# Altium schematic sheet DI_DO.SchDoc
size A3; SheetNumber: 4; SheetTotal: 4
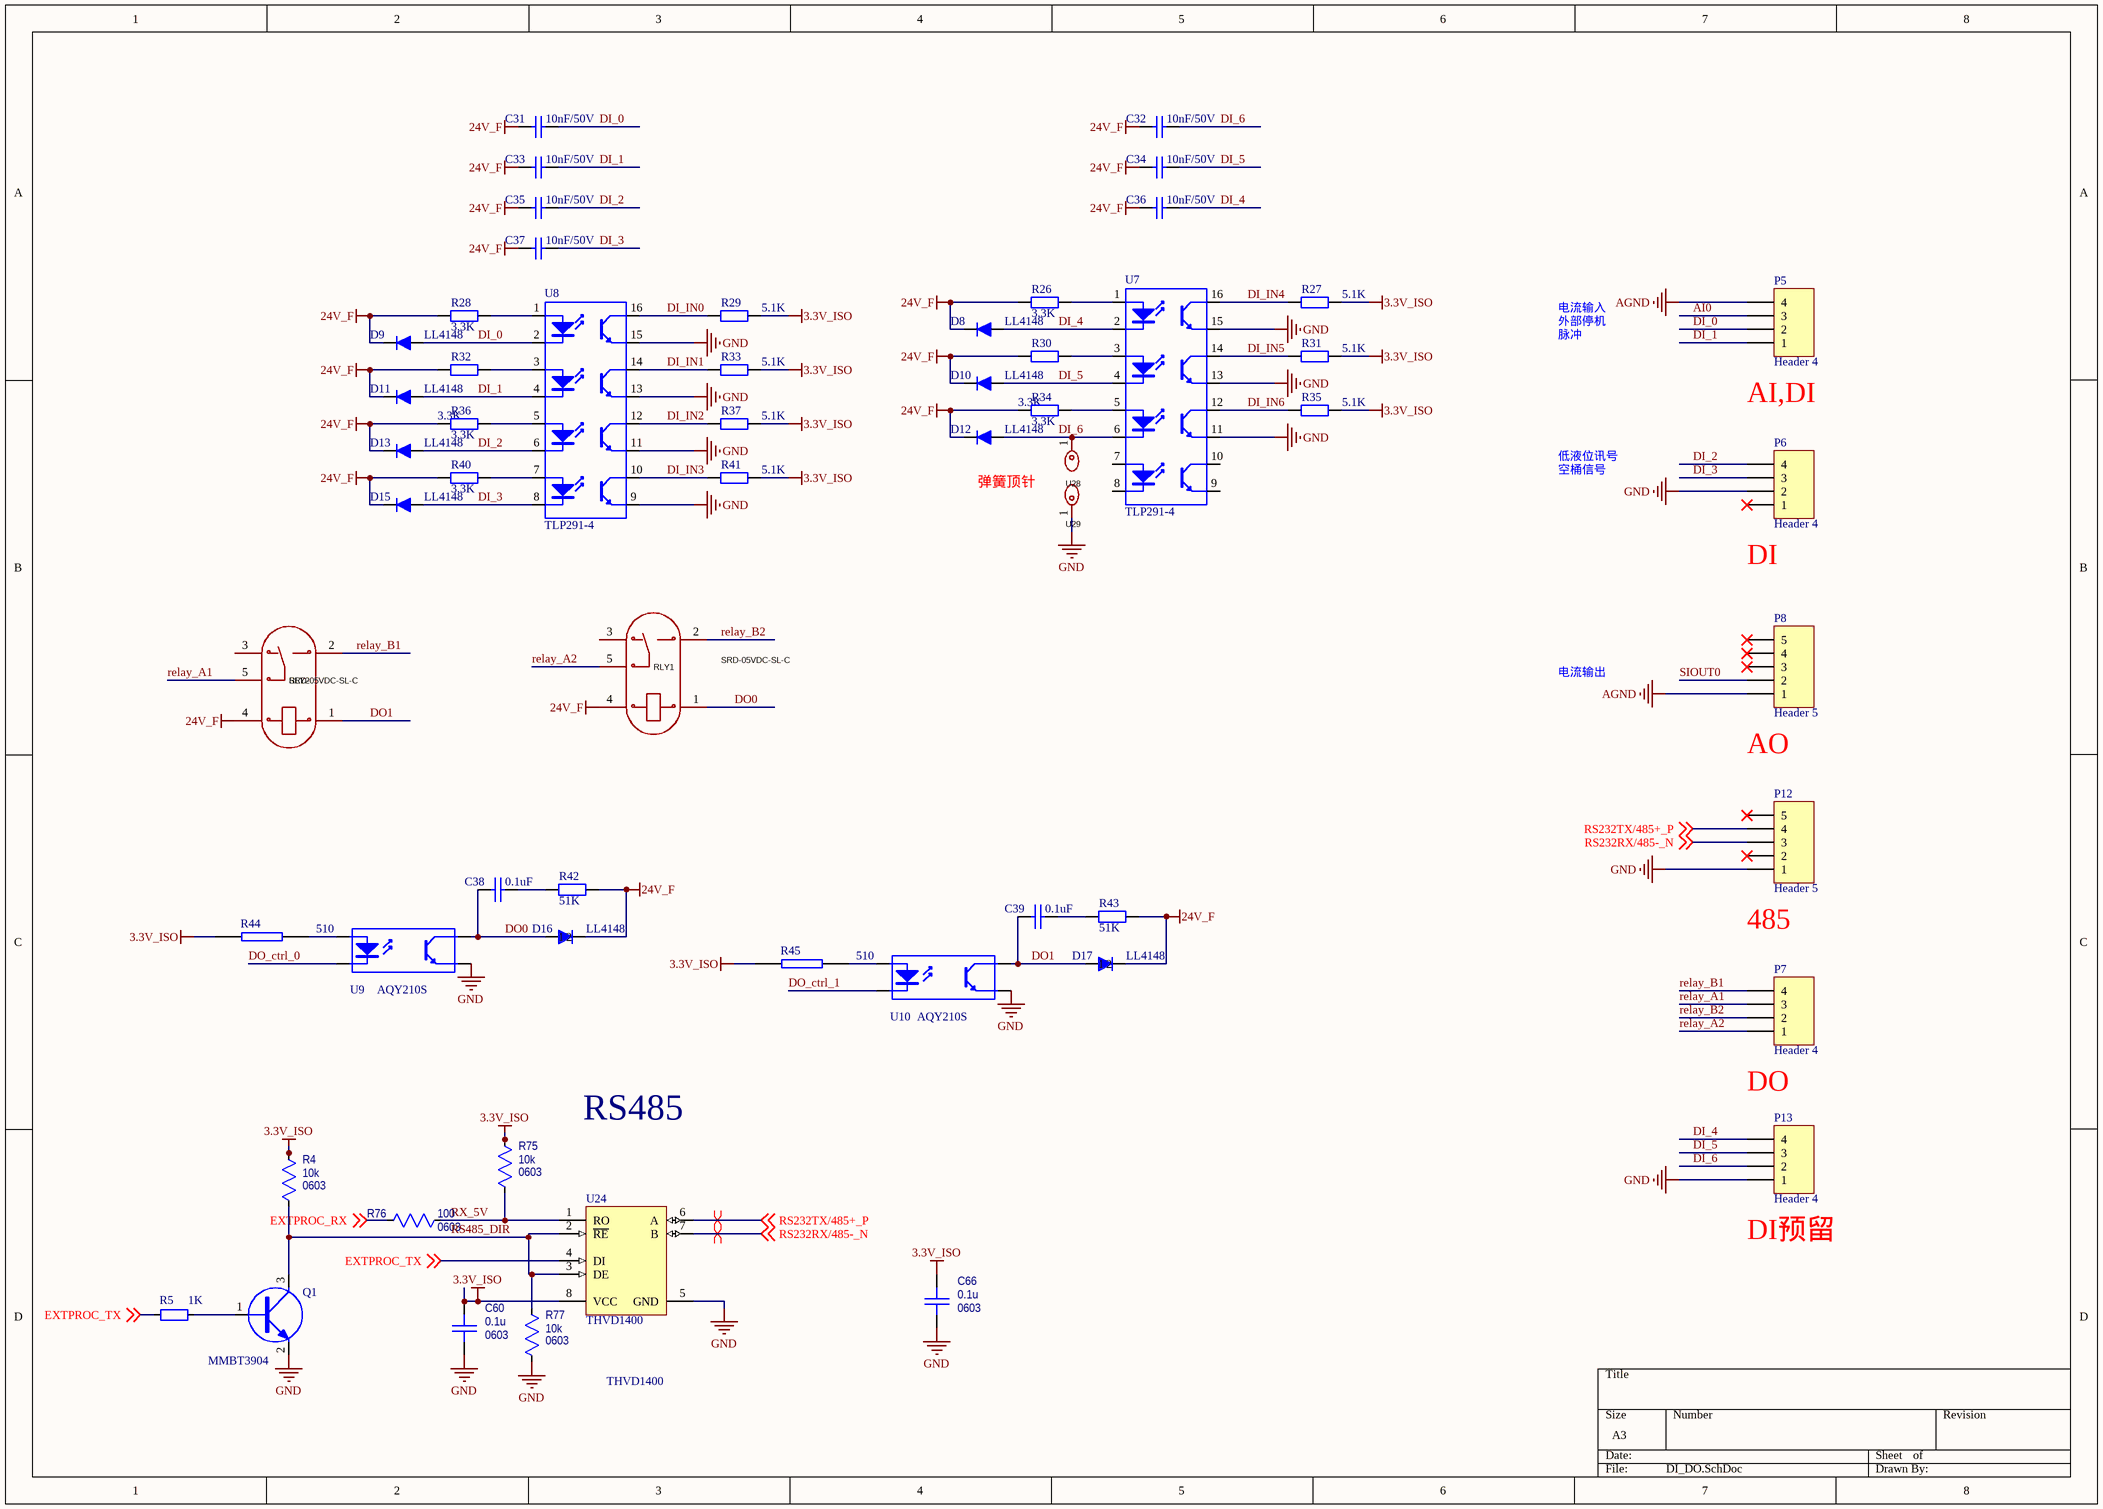
[diagram p0: DI_DO.SchDoc]

## Parts
C31  10nF/50V  [0603C]
C32  10nF/50V  [0603C]
C33  10nF/50V  [0603C]
C34  10nF/50V  [0603C]
C35  10nF/50V  [0603C]
C36  10nF/50V  [0603C]
C37  10nF/50V  [0603C]
C38  0.1uF  [0603C]
C39  0.1uF  [0603C]
C60  value 0.1u  Package: 0603  [CAPC1608X092N_0603]  (hidden comment: Capacitor_0603)
C66  value 0.1u  Package: 0603  [CAPC1608X092N_0603]  (hidden comment: Capacitor_0603)
D8  LL4148  [DO-213AB/LL34/MiniMELF]
D9  LL4148  [DO-213AB/LL34/MiniMELF]
D10  LL4148  [DO-213AB/LL34/MiniMELF]
D11  LL4148  [DO-213AB/LL34/MiniMELF]
D12  LL4148  [DO-213AB/LL34/MiniMELF]
D13  LL4148  [DO-213AB/LL34/MiniMELF]
D15  LL4148  [DO-213AB/LL34/MiniMELF]
D16  LL4148  [DO-213AB/LL34/MiniMELF]
D17  LL4148  [DO-213AB/LL34/MiniMELF]
P5  Header 4  [CONN#PH2.0-4A]
P6  Header 4  [CONN#PH2.0-4A]
P7  Header 4  [CONN#PH2.0-4A]
P8  Header 5  [CONN#PH2.0-5A]
P12  Header 5  [CONN#PH2.0-5A]
P13  Header 4  [CONN#PH2.0-4A]
Q1  MMBT3904  [SOT23-3]
R4  value 10k  Package: 0603  [RESC1608X055N_0603]  (hidden comment: Resistor_0603)
R5  1K  [0603r]
R26  3.3K  [0603R]
R27  5.1K  [0603R]
R28  3.3K  [0603R]
R29  5.1K  [0603R]
R30  3.3K  [0603R]
R31  5.1K  [0603R]
R32  3.3K  [0603R]
R33  5.1K  [0603R]
R34  3.3K  [0603R]
R35  5.1K  [0603R]
R36  3.3K  [0603R]
R37  5.1K  [0603R]
R40  3.3K  [0603R]
R41  5.1K  [0603R]
R42  51K  [0603R]
R43  51K  [0603R]
R44  510  [0603R]
R45  510  [0603R]
R75  value 10k  Package: 0603  [RESC1608X055N_0603]  (hidden comment: Resistor_0603)
R76  value 100  Package: 0603  [RESC1608X055N_0603]  (hidden comment: Resistor_0603)
R77  value 10k  Package: 0603  [RESC1608X055N_0603]  (hidden comment: Resistor_0603)
RLY1  SRD-05VDC-SL-C  [RELAY-TH_SRD-XXVDC-XL-C]
RLY2  SRD-05VDC-SL-C  [RELAY-TH_SRD-XXVDC-XL-C]
U7  TLP291-4  [SOP16-T]
U8  TLP291-4  [SOP16-T]
U9  AQY210S  [sop4]
U10  AQY210S  [sop4]
U24  THVD1400  [MAXM-S8+4_M]
U28  YTC1P-3015-01  [CONN-SMD_YTC1P-3015-01]  (value not drawn)
U29  YTC1P-3015-01  [CONN-SMD_YTC1P-3015-01]  (value not drawn)

## Nets
3.3V_ISO: C60.1 C66.1 R4.2 R27.1 R29.1 R31.1 R33.1 R35.1 R37.1 R41.1 R44.2 R45.2 R75.2 U24.8(VCC)
24V_F: C31.1 C32.1 C33.1 C34.1 C35.1 C36.1 C37.1 D8.2 D9.2 D10.2 D11.2 D12.2 D13.2 D15.2 D16.2(1) D17.2(1) R26.2 R28.2 R30.2 R32.2 R34.2 R36.2 R40.2 R42.2 R43.2 RLY1.4 RLY2.4
AGND: P5.4 P8.1
GND: C60.2 C66.2 P6.2 P12.1 P13.1 Q1.2(E) R77.1 U7.11(E) U7.13(E) U7.15(E) U8.9(E) U8.11(E) U8.13(E) U8.15(E) U9.3(E) U10.3(E) U24.5(GND) U29.1
AI0: P5.3
DI_0: C31.2 D9.1 P5.2 U8.2(K)
DI_1: C33.2 D11.1 P5.1 U8.4(K)
DI_2: C35.2 D13.1 P6.4 U8.6(K)
DI_3: C37.2 D15.1 P6.3 U8.8(K)
DI_4: C36.2 D8.1 P13.4 U7.2(K)
DI_5: C34.2 D10.1 P13.3 U7.4(K)
DI_6: C32.2 D12.1 P13.2 U7.6(K) U28.1
DI_IN0: R29.2 U8.16(C)
DI_IN1: R33.2 U8.14(C)
DI_IN2: R37.2 U8.12(C)
DI_IN3: R41.2 U8.10(C)
DI_IN4: R27.2 U7.16(C)
DI_IN5: R31.2 U7.14(C)
DI_IN6: R35.2 U7.12(C)
DO0: C38.1 D16.1(2) RLY1.1 U9.4(C)
DO1: C39.1 D17.1(2) RLY2.1 U10.4(C)
DO_ctrl_0: U9.2(K)
DO_ctrl_1: U10.2(K)
EXTPROC_RX: R76.2 ; off-sheet EXTPROC_RX
EXTPROC_TX: R5.1 U24.4(DI) ; off-sheet EXTPROC_TX
relay_A1: P7.3 RLY2.5
relay_A2: P7.1 RLY1.5
relay_B1: P7.4 RLY2.2
relay_B2: P7.2 RLY1.2
RS232RX/485-_N: P12.3 U24.7(B) ; off-sheet RS232RX/485-_N
RS232TX/485+_P: P12.4 U24.6(A) ; off-sheet RS232TX/485+_P
RS485_DIR: Q1.3(C) R4.1 R77.2 U24.2(~{RE}) U24.3(DE)
RX_5V: R75.1 R76.1 U24.1(RO)
SIOUT0: P8.2
NetC38_2: C38.2 R42.1
NetC39_2: C39.2 R43.1
NetQ1_1: Q1.1(B) R5.2
NetR26_1: R26.1 U7.1(A)
NetR28_1: R28.1 U8.1(A)
NetR30_1: R30.1 U7.3(A)
NetR32_1: R32.1 U8.3(A)
NetR34_1: R34.1 U7.5(A)
NetR36_1: R36.1 U8.5(A)
NetR40_1: R40.1 U8.7(A)
NetR44_1: R44.1 U9.1(A)
NetR45_1: R45.1 U10.1(A)

Not connected (* = marked no-connect by the designer): P6 1*; P8 3* 4* 5*; P12 2* 5*; RLY1 3; RLY2 3; U7 7(A) 8(K) 9(E) 10(C)

## Layout directives
differential pair: RS232RX/485-_N, RS232TX/485+_P

## Notes on the sheet
- 电流输入
- 外部停机
- 脉冲
- AI,DI
- (near D12) 弹簧顶针
- 低液位讯号
- 空桶信号
- (near P6) DI
- 电流输出
- AO
- 485
- RS485
- DO
- (near P13) DI预留
- THVD1400

## Library data of the parts
C31-C37 = Cap: Capacitor; Value: 22nF; Published: 8-Jun-2000; LatestRevisionDate: 17-Jul-2002; LatestRevisionNote: Re-released for DXP Platform.; PackageReference: RAD-0.3; Publisher: Altium Limited; PackageDescription: Radial Cap, Thru-Hole; 2 Leads; 0.3 in Pin Spacing
C38 C39 = CAP: Capacitor
C60 C66 = Capacitor_0603: Capacitor, MLCC; PartNumber: C0603C104M5RACTU; Tolerance: [tol]; TempCo: [tempco]; Voltage Rating: [voltage]; ComponentLink1URL: *; ComponentLink1Description: Datasheet; SupplierDescription: CAP CER 0.1UF 50V X7R 0603
D8-D13 D15-D17 = LL4148: VISHAY,LL4148,圆柱体MiniMELF100V/2A,ROHS; 版本: V1.00; 名称: 快速开关二极管; 物料编号: APLLY; 制造商: VISHAY
P5-P7 P13 = Header 4: Header, 4-Pin; LatestRevisionDate: 17-Jul-2002; LatestRevisionNote: Re-released for DXP Platform.; Publisher: Altium Limited
P8 P12 = Header 5: Header, 5-Pin; LatestRevisionDate: 17-Jul-2002; LatestRevisionNote: Re-released for DXP Platform.; Publisher: Altium Limited
Q1 = NPN_MMBT3904
R4 R75 R77 = Resistor_0603: Resistor, Standard; PartNumber: RC0603FR-0710KL; TempCo: [tempco]; Tolerance: tol; ComponentLink1URL: *; ComponentLink1Description: Datasheet; SupplierDescription: RES SMD 10K OHM 1% 1/10W 0603
R5 = RES0603: 物料主编码(PN): 150000040; ID: 233; 序号: 109; 物料名称: 贴片电阻; 精度: ±1%; 规格型号(完整型号): RC1608F103CS/RC0603FR-0710KL; 物料描述: RES,贴片电阻,0603,10k,±1%,1/10W,1.6X0.8X0.45mm,RC1608F103CS/RC0603FR-0710KL; 工作温度: –55°C to 155°C; 制造商: 三星/YAGEO; 器件等级: ——; 物料类型: 表贴电阻; 参数值: 1.00E+04; Value: 1K
R26-R37 R40-R43 = Res0805M
R44 R45 = RES2
R76 = Resistor_0603: Resistor, Standard; PartNumber: RC0603FR-07100RL; TempCo: [tempco]; Tolerance: tol; ComponentLink1URL: *; ComponentLink1Description: Datasheet; SupplierDescription: RES SMD 100 OHM 1% 1/10W 0603
RLY1 RLY2 = SRD-05VDC-SL-C: Manufacturer: 松乐; Add into BOM: yes; Coil Voltage: 5V; Contact Form: 一组转换:1C(单刀双掷-转换); Pin Number: 5; Maximum Switching Voltage: 250V@AC; Coil Rated Power: 360mW; Maximum Switching Current: 15A; Coil Type: 无极性-单线圈; Coil Resistance: 70Ω; Contact Resistance: 100mΩ; Operate Time: 10ms; Symbol: SRD-05VDC-SL-C; Device: SRD-05VDC-SL-C; LCSC Part Name: 蓝色; Supplier Part: C35449; Manufacturer Part: SRD-05VDC-SL-C; Supplier Footprint: 插件,15.6x19.2mm; JLCPCB Part Class: Extended Part; Datasheet: https://atta.szlcsc.com/upload/public/pdf/source/20200305/C490149_C96E4098A3B1FFB377D5AD2E40B7C2A8.pdf; Supplier: LCSC; Convert to PCB: yes; Contact Rating: -; Release Time: 10ms
U7 U8 = TLP281-4
U9 U10 = Optoisolator1: 4-Pin Phototransistor Optocoupler; Published: 24-Mar-1999; LatestRevisionDate: 04-Mar-2005; LatestRevisionNote: Sch pins 3 & 4 Swapped.; DatasheetVersion: Nov-2003; PackageReference: DIP-4; Publisher: Altium Limited
U24 = MAX33071EASA+: RS-485 Half-Duplex Transceiver with ±65V Fault Protection,+3V to +5.5V, -40 to 125 degC, 8-Pin SOIC (S8+4), RoHS, Tube; VOUT: 3.000 V; VIN: 3.2 to 12.6 V; PartNumber: MAX33071EASA+; ComponentLink1URL: http://www.maximintegrated.com/; ComponentLink1Description: Manufacturer URL; ComponentLink2URL: https://datasheets.maximintegrated.com/en/ds/MAX33070E-MAX33071E.pdf; ComponentLink2Description: Datasheet; Value: MAX33071EASA+
U28 U29 = YTC1P-3015-01: Manufacturer: YIYUAN(怡远); Add into BOM: yes; Overall Length/Height: 4.5mm; Rated Current: 2.5A; Rated Voltage: 12V; Symbol: YTC1P-3015-01; Device: YTC1P-3015-01; LCSC Part Name: POGO PIN弹簧顶针 贴片连接器; Supplier Part: C5221293; Manufacturer Part: YTC1P-3015-01; Supplier Footprint: -; JLCPCB Part Class: Extended Part; Datasheet: https://atta.szlcsc.com/upload/public/pdf/source/20221031/BD070516233C1C93A35D01CFB419D0D5.pdf; Supplier: LCSC; Convert to PCB: yes; Type: 弹簧顶针(POGO PIN); Number of Pins: 单PIN位; Contact Material: 黄铜; Contact Plating: 金; Comment_1: YTC1P-3015-01